# Altium schematic sheet eBox_Notes.SchDoc: eBox_Notes
size A4; DocumentNumber: 1; SheetNumber: 1; SheetTotal: 9
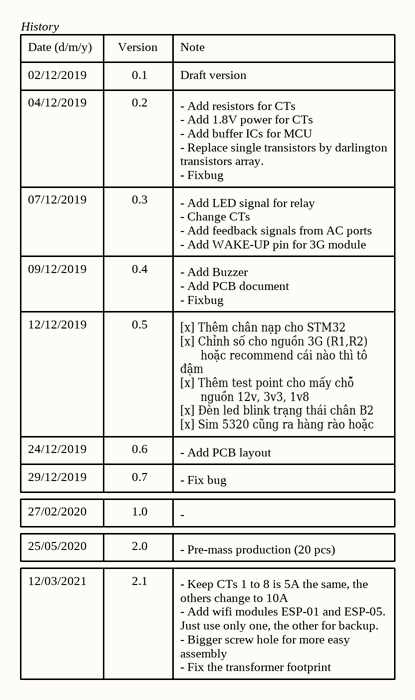
[diagram p0: eBox_Notes.SchDoc]

## Notes on the sheet
- History
- Date (d/m/y)
- 02/12/2019
- Version
- 0.1
- Note
- Draft version
- 04/12/2019
- 0.2
- 07/12/2019
- 0.3
- - Add resistors for CTs
  - Add 1.8V power for CTs
  - Add buffer ICs for MCU
  - Replace single transistors by darlington  transistors array.
  - Fixbug
- 09/12/2019
- 0.4
- - Add LED signal for relay
  - Change CTs
  - Add feedback signals from AC ports
  - Add WAKE-UP pin for 3G module
- 12/12/2019
- 0.5
- - Add Buzzer
  - Add PCB document
  - Fixbug
- [x] Thêm chân nạp cho STM32
  [x] Chỉnh số cho nguồn 3G (R1,R2)
  hoặc recommend cái nào thì tô đậm
  [x] Thêm test point cho mấy chỗ
  nguồn 12v, 3v3, 1v8
  [x] Đèn led blink trạng thái chân B2
  [x] Sim 5320 cũng ra hàng rào hoặc
  test point uart để test
- 24/12/2019
- 29/12/2019
- 0.6
- 0.7
- - Add PCB layout
- - Fix bug
- 27/02/2020
- 25/05/2020
- 1.0
- 2.0
- -
- - Pre-mass production (20 pcs)
- 12/03/2021
- 2.1
- - Keep CTs 1 to 8 is 5A the same, the others change to 10A
  - Add wifi modules ESP-01 and ESP-05. Just use only one, the other for backup.
  - Bigger screw hole for more easy assembly
  - Fix the transformer footprint
  - Use 5V power supply for the temperature sensor
- Title
- Size:
- Date:
- A4
- Number:
- Time:
- Revision:
- Sheet
- of
- NPN
- Lab
- File: